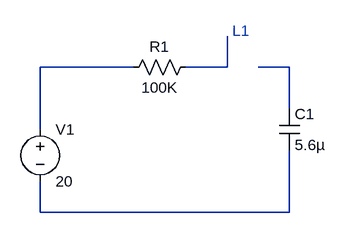
[diagram p0: schematic EJ3_teoría.asc]
EJ3_teoría.asc, the LTspice schematic file:
Version 4.1
SHEET 1 920 680
WIRE 240 -144 96 -144
WIRE 384 -144 384 -192
WIRE 384 -144 320 -144
WIRE 480 -144 432 -144
WIRE 480 -80 480 -144
WIRE 96 -48 96 -144
WIRE 96 80 96 32
WIRE 480 80 480 -16
WIRE 480 80 96 80
SYMBOL voltage 96 -64 R0
SYMATTR InstName V1
SYMATTR Value 20
SYMBOL res 336 -160 R90
WINDOW 0 0 56 VBottom 2
WINDOW 3 32 56 VTop 2
SYMATTR InstName R1
SYMATTR Value 100K
SYMBOL cap 464 -80 R0
SYMATTR InstName C1
SYMATTR Value 5.6µ
TEXT 392 -200 Left 2 ;L1

The netlist it stands for:
* EJ3_teoría.asc
V1 N001 N004 20
R1 N002 N001 100K
C1 N003 N004 5.6µ
* L1
.backanno
.end